# Altium schematic sheet DriverControlsCarrierBoardMezzanine.SchDoc: Controller Board Interface
size Letter; Organization: Midnight Sun Solar Rayce Car Team; Address1: University of Waterloo; Address2: 200 University Ave W; Address3: Waterloo, ON, Canada; Address4: N2L 3E9; SheetNumber: 1; SheetTotal: 2; Website: www.uwmidsun.com
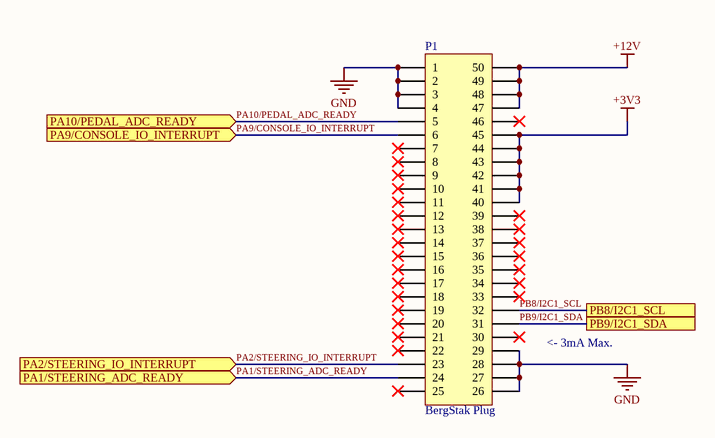
[diagram p0: DriverControlsCarrierBoardMezzanine.SchDoc]

## Parts
P1  Series: BergStak Plug  [CONN, Bergstak 50 Pos Plug]  (hidden comment: CONN 50POS Bergstak Plug 0.02")

## Ports
PA1/STEERING_ADC_READY (in), PA2/STEERING_IO_INTERRUPT (in), PA9/CONSOLE_IO_INTERRUPT (in), PA10/PEDAL_ADC_READY (in), PB8/I2C1_SCL, PB9/I2C1_SDA

## Nets
+3V3: P1.40 P1.41 P1.42 P1.43 P1.44 P1.45
+12V: P1.47 P1.48 P1.49 P1.50
GND: P1.1 P1.2 P1.3 P1.4 P1.26 P1.27 P1.28 P1.29
PA1/STEERING_ADC_READY: P1.24 ; port PA1/STEERING_ADC_READY
PA2/STEERING_IO_INTERRUPT: P1.23 ; port PA2/STEERING_IO_INTERRUPT
PA9/CONSOLE_IO_INTERRUPT: P1.6 ; port PA9/CONSOLE_IO_INTERRUPT
PA10/PEDAL_ADC_READY: P1.5 ; port PA10/PEDAL_ADC_READY
PB8/I2C1_SCL: P1.32 ; port PB8/I2C1_SCL
PB9/I2C1_SDA: P1.31 ; port PB9/I2C1_SDA

Not connected (* = marked no-connect by the designer): P1 7* 8* 9* 10* 11* 12* 13* 14* 15* 16* 17* 18* 19* 20* 21* 22* 25* 30* 33* 34* 35* 36* 37* 38* 39* 46*

## Notes on the sheet
- <- 3mA Max.
- Project:
- Title:
- Size:
- Project Author
- Letter
- Revision:
- University of Waterloo
- 200 University Ave W
- Waterloo, ON, Canada
- N2L 3E9
- Date:
- Sheet
- of
- Website:

## Library data of the parts
P1 = CONN 50POS Bergstak Plug 0.02": 50 Position Connector Plug, Outer Shroud Contacts Surface Mount Gold; Manufacturer 1: Amphenol FCI; Manufacturer Part Number 1: 10132797-055100LF; Number of Positions: 50; Mated Stacking Heights: 5mm; Pitch: 0.020" (0.50mm); Supplier 1: Digi-Key; Supplier Part Number 1: 609-5226-1-ND; Packaging: Cut Tape (CT); Part Status: Active; Connector Type: Plug, Outer Shroud Contacts; Number of Rows: 2; Mounting Type: Surface Mount; Contact Finish: Gold; Contact Finish Thickness: 1µin (0.025µm); Height Above Board: 0.169" (4.30mm); ComponentLink1URL: http://portal.fciconnect.com/Comergent//fci/drawing/10132797.pdf; ComponentLink1Description: http://portal.fciconnect.com/Comergent//fci/drawing/10132797.pdf